# Altium schematic sheet sheet0.SchDoc
size A4
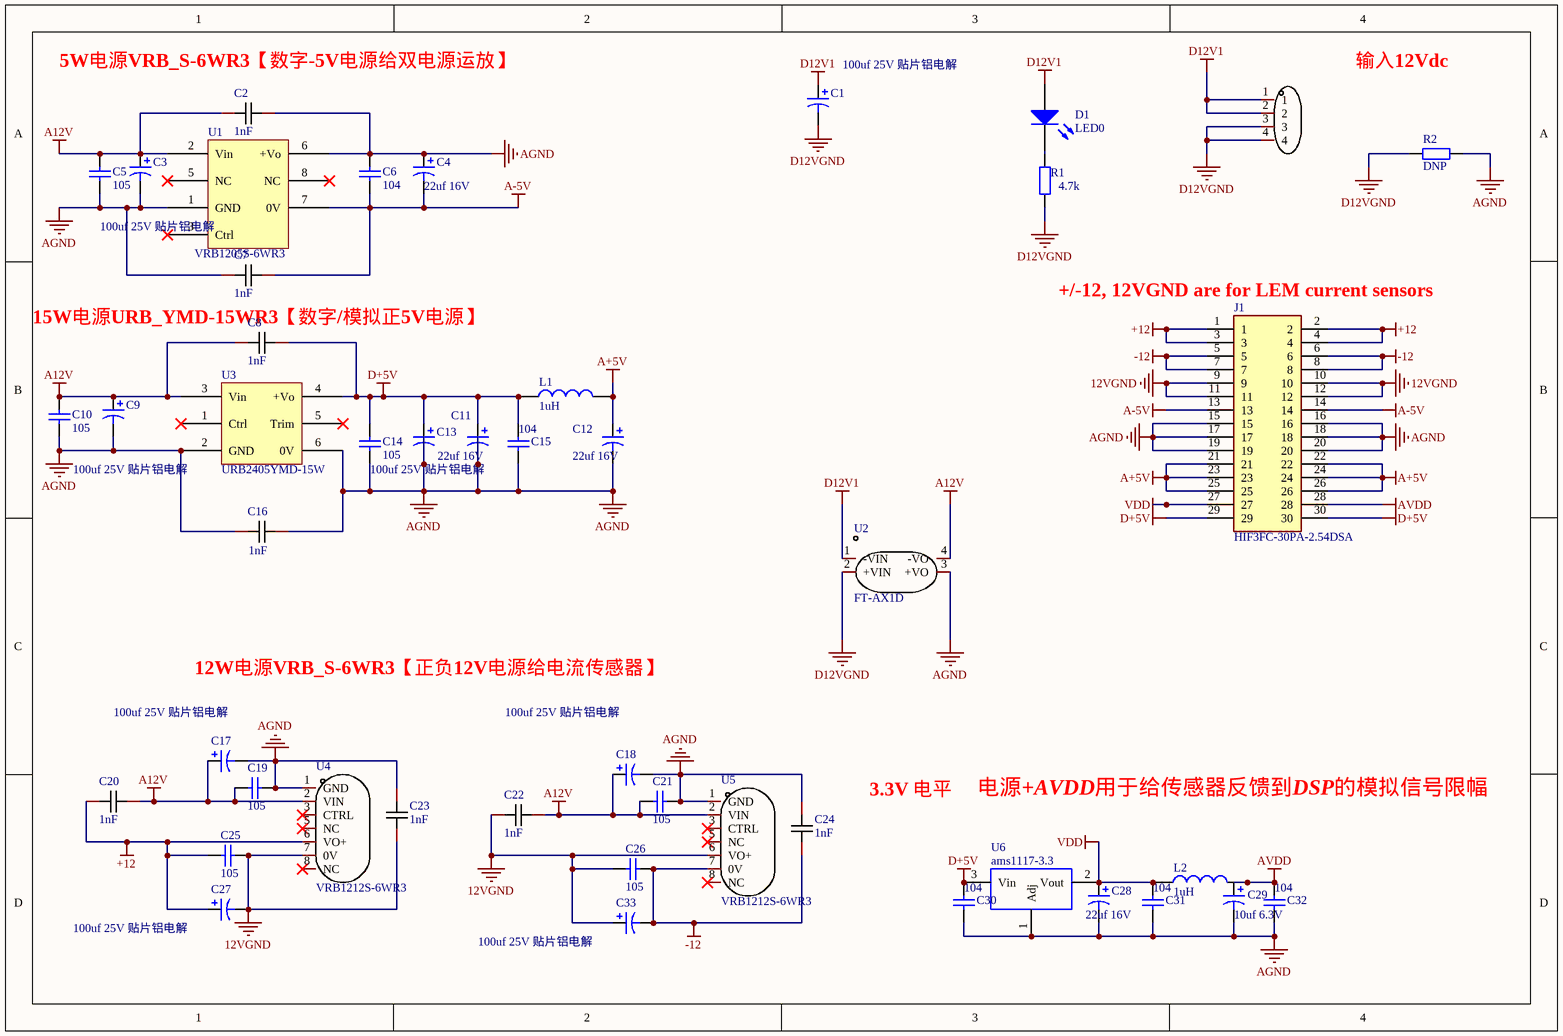
[diagram p0: sheet0.SchDoc]

## Parts
C1  100uf 25V 贴片铝电解  [CAP/6.4mm -]
C2  1nF  [CAP-TH_L7.5-W4.5-P10.00-D0.6]
C3  100uf 25V 贴片铝电解  [CAP/6.4mm -]
C4  22uf 16V  [1206 (钽电容)]
C5  105  [0805]
C6  104  [0805]
C7  1nF  [CAP-TH_L7.5-W4.5-P10.00-D0.6]
C8  1nF  [CAP-TH_L7.5-W4.5-P10.00-D0.6]
C9  100uf 25V 贴片铝电解  [CAP/6.4mm -]
C10  105  [0805]
C11  22uf 16V  [1206 (钽电容)]
C12  22uf 16V  [1206 (钽电容)]
C13  100uf 25V 贴片铝电解  [CAP/6.4mm -]
C14  105  [0805]
C15  104  [0805]
C16  1nF  [CAP-TH_L7.5-W4.5-P10.00-D0.6]
C17  100uf 25V 贴片铝电解  [CAP/6.4mm -]
C18  100uf 25V 贴片铝电解  [CAP/6.4mm -]
C19  105  [0805]
C20  1nF  [CAP-TH_L7.5-W4.5-P10.00-D0.6]
C21  105  [0805]
C22  1nF  [CAP-TH_L7.5-W4.5-P10.00-D0.6]
C23  1nF  [CAP-TH_L7.5-W4.5-P10.00-D0.6]
C24  1nF  [CAP-TH_L7.5-W4.5-P10.00-D0.6]
C25  105  [0805]
C26  105  [0805]
C27  100uf 25V 贴片铝电解  [CAP/6.4mm -]
C28  22uf 16V  [1206 (钽电容)]
C29  10uf 6.3V  [1206 (钽电容)]
C30  104  [0805]
C31  104  [0805]
C32  104  [0805]
C33  100uf 25V 贴片铝电解  [CAP/6.4mm -]
CN1  DB2EVC-3.81-4P-GN  [CONN-TH_4P-P3.81_DB2EVC-3.81-4P]  (value not drawn)
D1  LED0  [l0805]
J1  HIF3FC-30PA-2.54DSA  [HDR2.54-LI-2x15P]
L1  1uH  [L 0805]
L2  1uH  [L 0805]
R1  4.7k  [0805]
R2  DNP  [2512]
U1  VRB1205S-6WR3  [VRB_S-6WR3]
U2  FT-AX1D  [PWRM-TH_MORNSUN_FT-AX1D]
U3  URB2405YMD-15W  [URB-YMD-15WR3]
U4  VRB1212S-6WR3  [PWRM-TH_VRB2405S-6WR3]
U5  VRB1212S-6WR3  [PWRM-TH_VRB2405S-6WR3]
U6  ams1117-3.3  [SOT-223]

## Nets
12VGND: C22.2 C23.2 C25.2 C26.1 C27.2 C33.1 J1.9 J1.10 J1.11 J1.12 U4.7(0V) U5.6(VO+)
+12: C20.2 C25.1 C27.1 J1.1 J1.2 J1.3 J1.4 U4.6(VO+)
-12: C24.2 C26.2 C33.2 J1.5 J1.6 J1.7 J1.8 U5.7(0V)
A12V: C2.1 C3.1 C5.1 C8.1 C9.1 C10.1 C17.1 C18.1 C19.1 C20.1 C21.1 C22.1 U1.2(Vin) U2.4(-VO) U3.3(Vin) U4.2(VIN) U5.2(VIN)
A+5V: C12.1 J1.21 J1.22 J1.23 J1.24 J1.25 J1.26 L1.2
A-5V: C4.2 C6.2 C7.2 J1.13 J1.14 U1.7(0V)
AGND: C2.2 C3.2 C4.1 C5.2 C6.1 C7.1 C9.2 C10.2 C11.2 C12.2 C13.2 C14.2 C15.1 C16.1 C16.2 C17.2 C18.2 C19.2 C21.2 C23.1 C24.1 C28.2 C29.2 C30.1 C31.1 C32.1 J1.15 J1.16 J1.17 J1.18 J1.19 J1.20 R2.2 U1.1(GND) U1.6(+Vo) U2.3(+VO) U3.2(GND) U3.6(0V) U4.1(GND) U5.1(GND) U6.1(Adj)
AVDD: C29.1 C32.2 J1.28 L2.2
D12V1: C1.1 CN1.1 CN1.2 D1.1(A) U2.1(-VIN)
D12VGND: C1.2 CN1.3 CN1.4 R1.1 R2.1 U2.2(+VIN)
D+5V: C8.2 C11.1 C13.1 C14.1 C15.2 C30.2 J1.29 J1.30 L1.1 U3.4(+Vo) U6.3(Vin)
VDD: C28.1 C31.2 J1.27 L2.1 U6.2(Vout)
NetD1_2: D1.2(K) R1.2

Not connected (* = marked no-connect by the designer): U1 3(Ctrl)* 5(NC)* 8(NC)*; U3 1(Ctrl)* 5(Trim)*; U4 3(CTRL)* 5(NC)* 8(NC)*; U5 3(CTRL)* 5(NC)* 8(NC)*

## Notes on the sheet
- (near C2) 5W电源VRB_S-6WR3【数字-5V电源给双电源运放】
- 输入12Vdc
- (near J1) +/-12, 12VGND are for LEM current sensors
- (near C8) 15W电源URB_YMD-15WR3【数字/模拟正5V电源】
- 12W电源VRB_S-6WR3【正负12V电源给电流传感器】
- 3.3V 电平
- 电源+AVDD用于给传感器反馈到DSP的模拟信号限幅

## Library data of the parts
C1 C3 C4 C9 C11-C13 C17 C18 C27-C29 C33 = Cap Pol1: Polarized Capacitor (Radial); Published: 8-Jun-2000; LatestRevisionDate: 17-Jul-2002; LatestRevisionNote: Re-released for DXP Platform.; Publisher: Altium Limited
  C3 C4 C9 C11-C13 C17 C18 C27-C29 C33: ClassName: Power
C2 C7 C8 C16 C20 C22-C24 = KY1102M400VAC70Y10093: 等级:Y1;容值:1nF;精度:±20%;电压(AC):400V;; Manufacturer: KNSCHA(科尼盛); Add into BOM: yes; Subclass: Y1; Tolerance: ±20%; Voltage(AC): 400V; Symbol: KY1102M400VAC70Y10093; Device: KY1102M400VAC70Y10093; LCSC Part Name: 等级:Y1 1nF ±20% 400V; Supplier Part: C2943996; Manufacturer Part: KY1102M400VAC70Y10093; Supplier Footprint: 插件,P=10mm; Datasheet: https://atta.szlcsc.com/upload/public/pdf/source/20220125/2D2B80E2C5D988A5B116EA64517B63EA.pdf; Supplier: LCSC; Convert to PCB: yes; Value: 1nF; Name: 1nF
C5 C6 C10 C14 C19 C21 C25 C26 = Cap: Capacitor; Value: 0.1UF; Published: 8-Jun-2000; LatestRevisionDate: 17-Jul-2002; LatestRevisionNote: Re-released for DXP Platform.; PackageReference: RAD-0.3; Publisher: Altium Limited; ClassName: Power
C15 C30-C32 = Cap Semi: Capacitor (Semiconductor SIM Model); Published: 8-Jun-2000; LatestRevisionDate: 17-Jul-2002; LatestRevisionNote: Re-released for DXP Platform.; PackageReference: C1206; Publisher: Altium Limited; ClassName: Power
CN1 = DB2EVC-3.81-4P-GN: Manufacturer: DIBO(地博电气); Add into BOM: yes; Connector Type: 板端/插座-闭口; Pitch: 3.81mm; Structure: 1x4P; Number of PINs Per Row: 4; Current Rating (Max): 10A; Voltage Rating (Max): 250V; Name: DB2EVC-3.81-4P-GN; Symbol: DB2EVC-3.81-4P; Device: DB2EVC-3.81-4P-GN; LCSC Part Name: 3.81mm 1x4P 排数:1 每排P数:4; Supplier Part: C395697; Manufacturer Part: DB2EVC-3.81-4P-GN; Supplier Footprint: 插件,P=3.81mm; JLCPCB Part Class: Extended Part; Datasheet: https://atta.szlcsc.com/upload/public/pdf/source/20230106/E295F87ABDAA44E449E4D4A582259339.pdf; Supplier: LCSC; Convert to PCB: yes; Number of Rows: 1; Number of Pins: 4P; Operating Temperature Range: -40℃~+105℃; Color: 绿色; Mounting Style: 直针
D1 = LED0: Typical INFRARED GaAs LED; Published: 8-Jun-2000; LatestRevisionDate: 08-Jul-2005; LatestRevisionNote: Mech Layer 1 removed.; PackageReference: LED-0; Publisher: Altium Limited; PackageDescription: LED; 2 Leads
J1 = HIF3FC-30PA-2.54DSA: Connector; Manufacturer_Name: Hirose; Manufacturer_Part_Number: HIF3FC-30PA-2.54DSA(71); Datasheet Link: https://datasheet.datasheetarchive.com/originals/distributors/SFDatasheet-7/sf-000141320.pdf; Height: 12mm; Mouser Part Number: 798-HIF3FC30PA254D71; Mouser Price/Stock: https://www.mouser.co.uk/ProductDetail/Hirose-Connector/HIF3FC-30PA-254DSA71?qs=eDUdFcBPps32%2FyAdBVx6ww%3D%3D; System: Connector
L1 L2 = L: 小功率贴片电感; 版权归属: 源创客; BOM名称: 小功率贴片电感; 学习资源: www.ooocke.com
R1 = Res2: Resistor; Value: 1K; Published: 8-Jun-2000; LatestRevisionDate: 17-Jul-2002; LatestRevisionNote: Re-released for DXP Platform.; PackageReference: AXIAL-0.4; Publisher: Altium Limited; PackageDescription: Axial Device, Thru-Hole; 2 Leads; 0.4 in Pin Spacing
R2 = Res2: Resistor; Published: 8-Jun-2000; LatestRevisionDate: 17-Jul-2002; LatestRevisionNote: Re-released for DXP Platform.; PackageReference: AXIAL-0.4; Publisher: Altium Limited; ClassName: Power
U1 U3 = Component_1: ClassName: Power
U2 = FT-AX1D: Manufacturer: MORNSUN(金升阳); Add into BOM: yes; Symbol: FT-AX1D; Device: FT-AX1D; LCSC Part Name: FT-AX1D; Supplier Part: C5127623; Manufacturer Part: FT-AX1D; Supplier Footprint: 插件; JLCPCB Part Class: 扩展库; Datasheet: https://atta.szlcsc.com/upload/public/pdf/source/20220812/46717D78754D3A4E3C88374812D1964E.pdf; Supplier: LCSC; Convert to PCB: yes; Name: FT-AX1D
U4 U5 = VRB1212S-6WR3: 输入电压(DC):9V~18V;输出电压:12V;输出电流(最大值):500mA;输出功率:6W;转换效率:84%;; Manufacturer: MORNSUN(金升阳); Add into BOM: yes; Output Channel: 1; Input Voltage(DC): 9V~18V; Output Voltage: 12V; Output Current (Max): 500mA; Output Power: 6W; Conversion Efficiency: 84%; Name: VRB1212S-6WR3; Symbol: VRB1212S-6WR3; Device: VRB1212S-6WR3; LCSC Part Name: 输入9V~18V 输出12V 500mA 6W; Supplier Part: C2684876; Manufacturer Part: VRB1212S-6WR3; Supplier Footprint: 插件; JLCPCB Part Class: 扩展库; Datasheet: https://atta.szlcsc.com/upload/public/pdf/source/20210113/C2684875_85B724204689EA7052A85B7ABECFAE60.pdf; Supplier: LCSC; Convert to PCB: yes
U6 = LM1117: ClassName: Power